# Altium schematic sheet SEQ.SchDoc
size A2
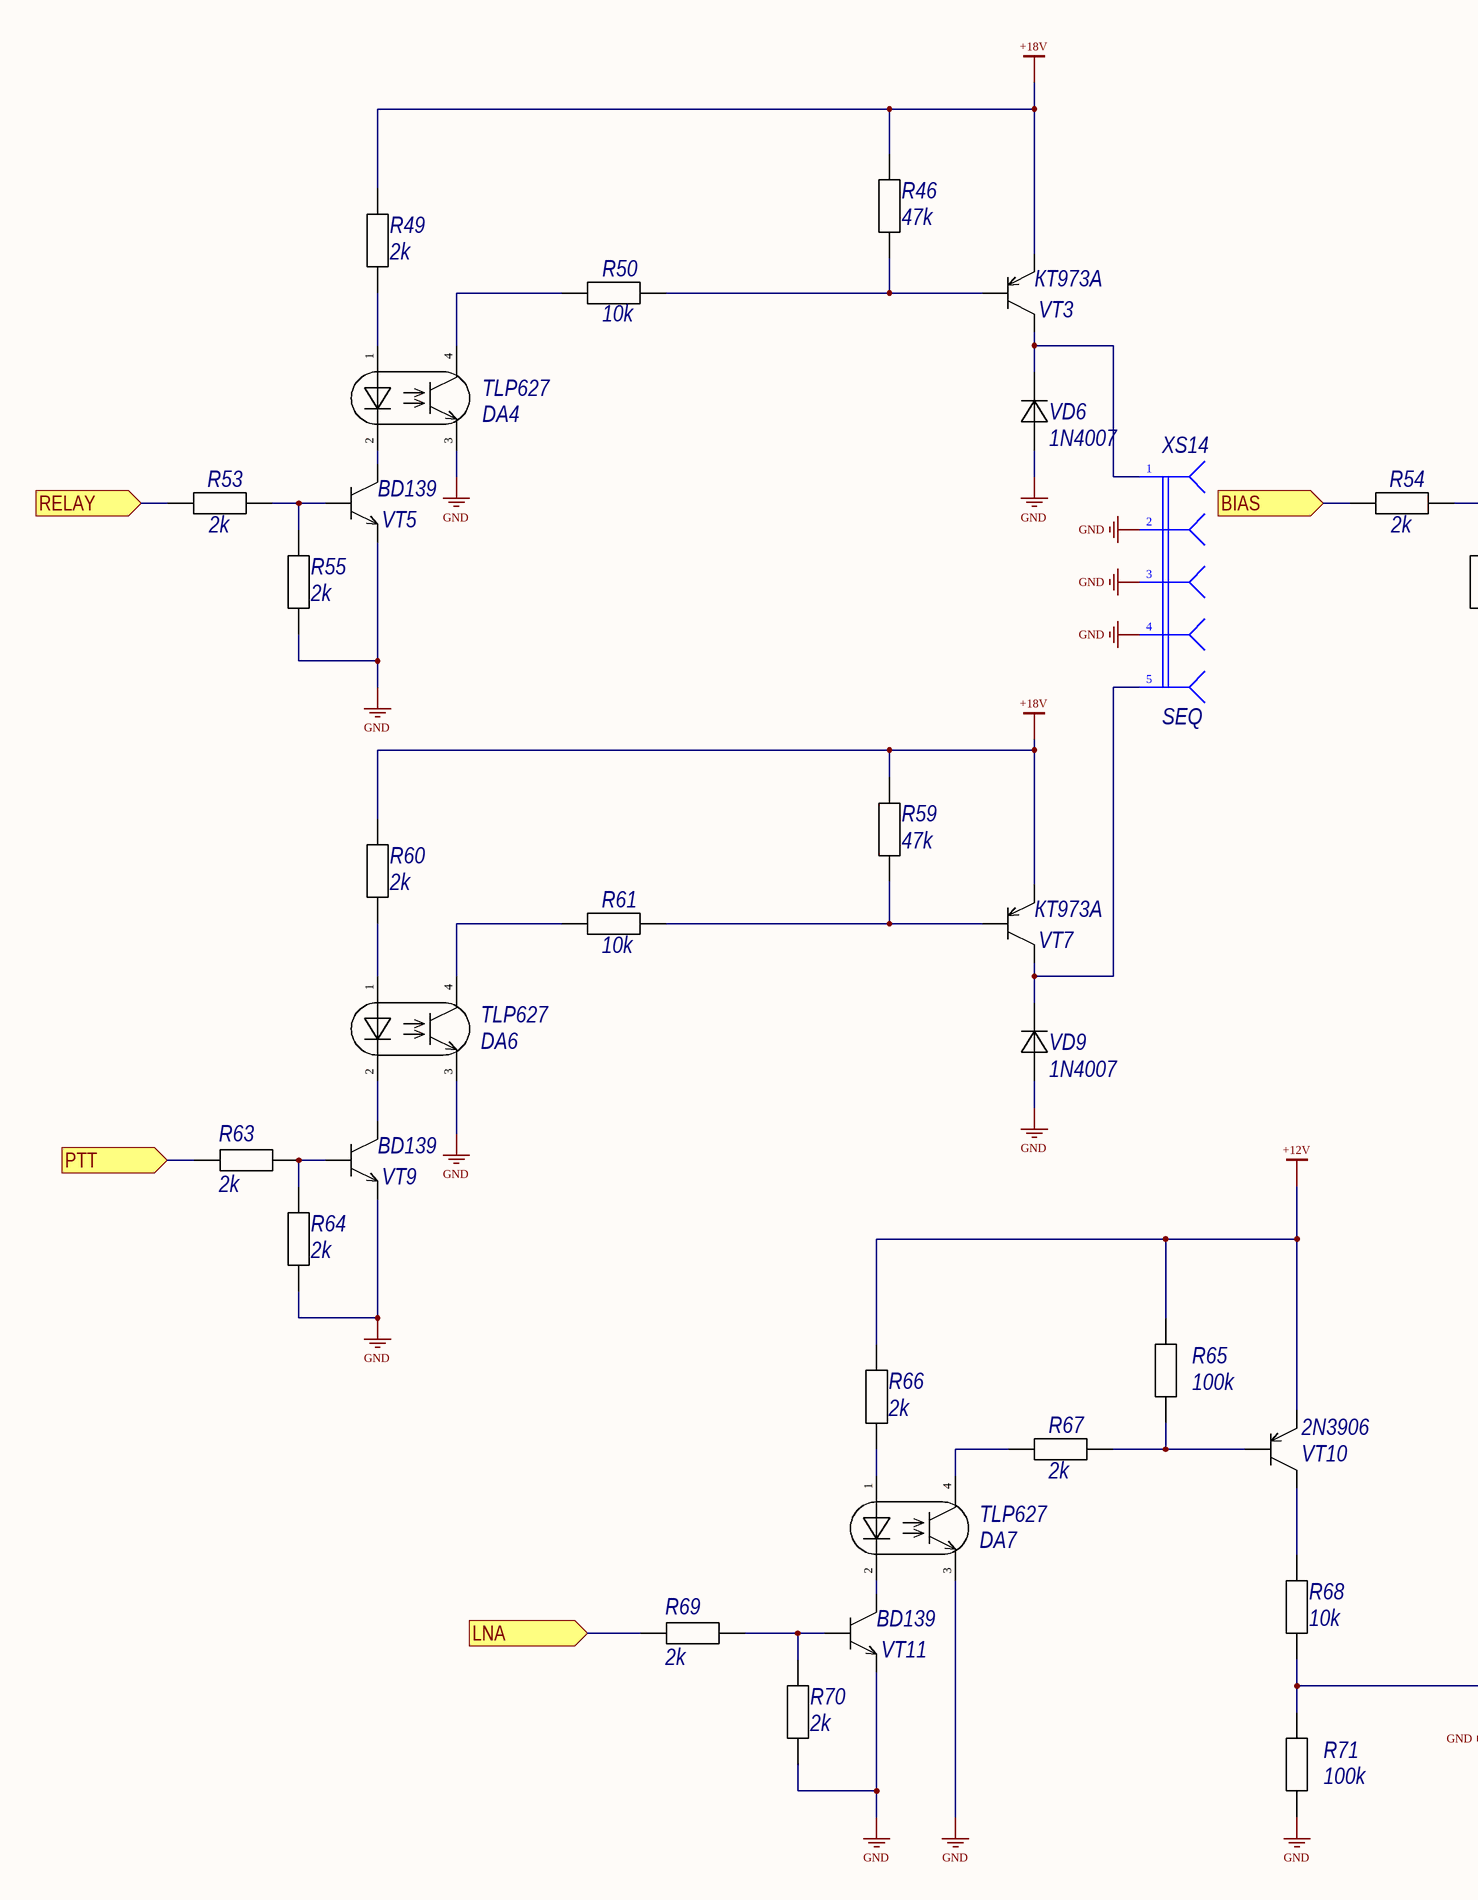
[diagram p0: SEQ.SchDoc, left]
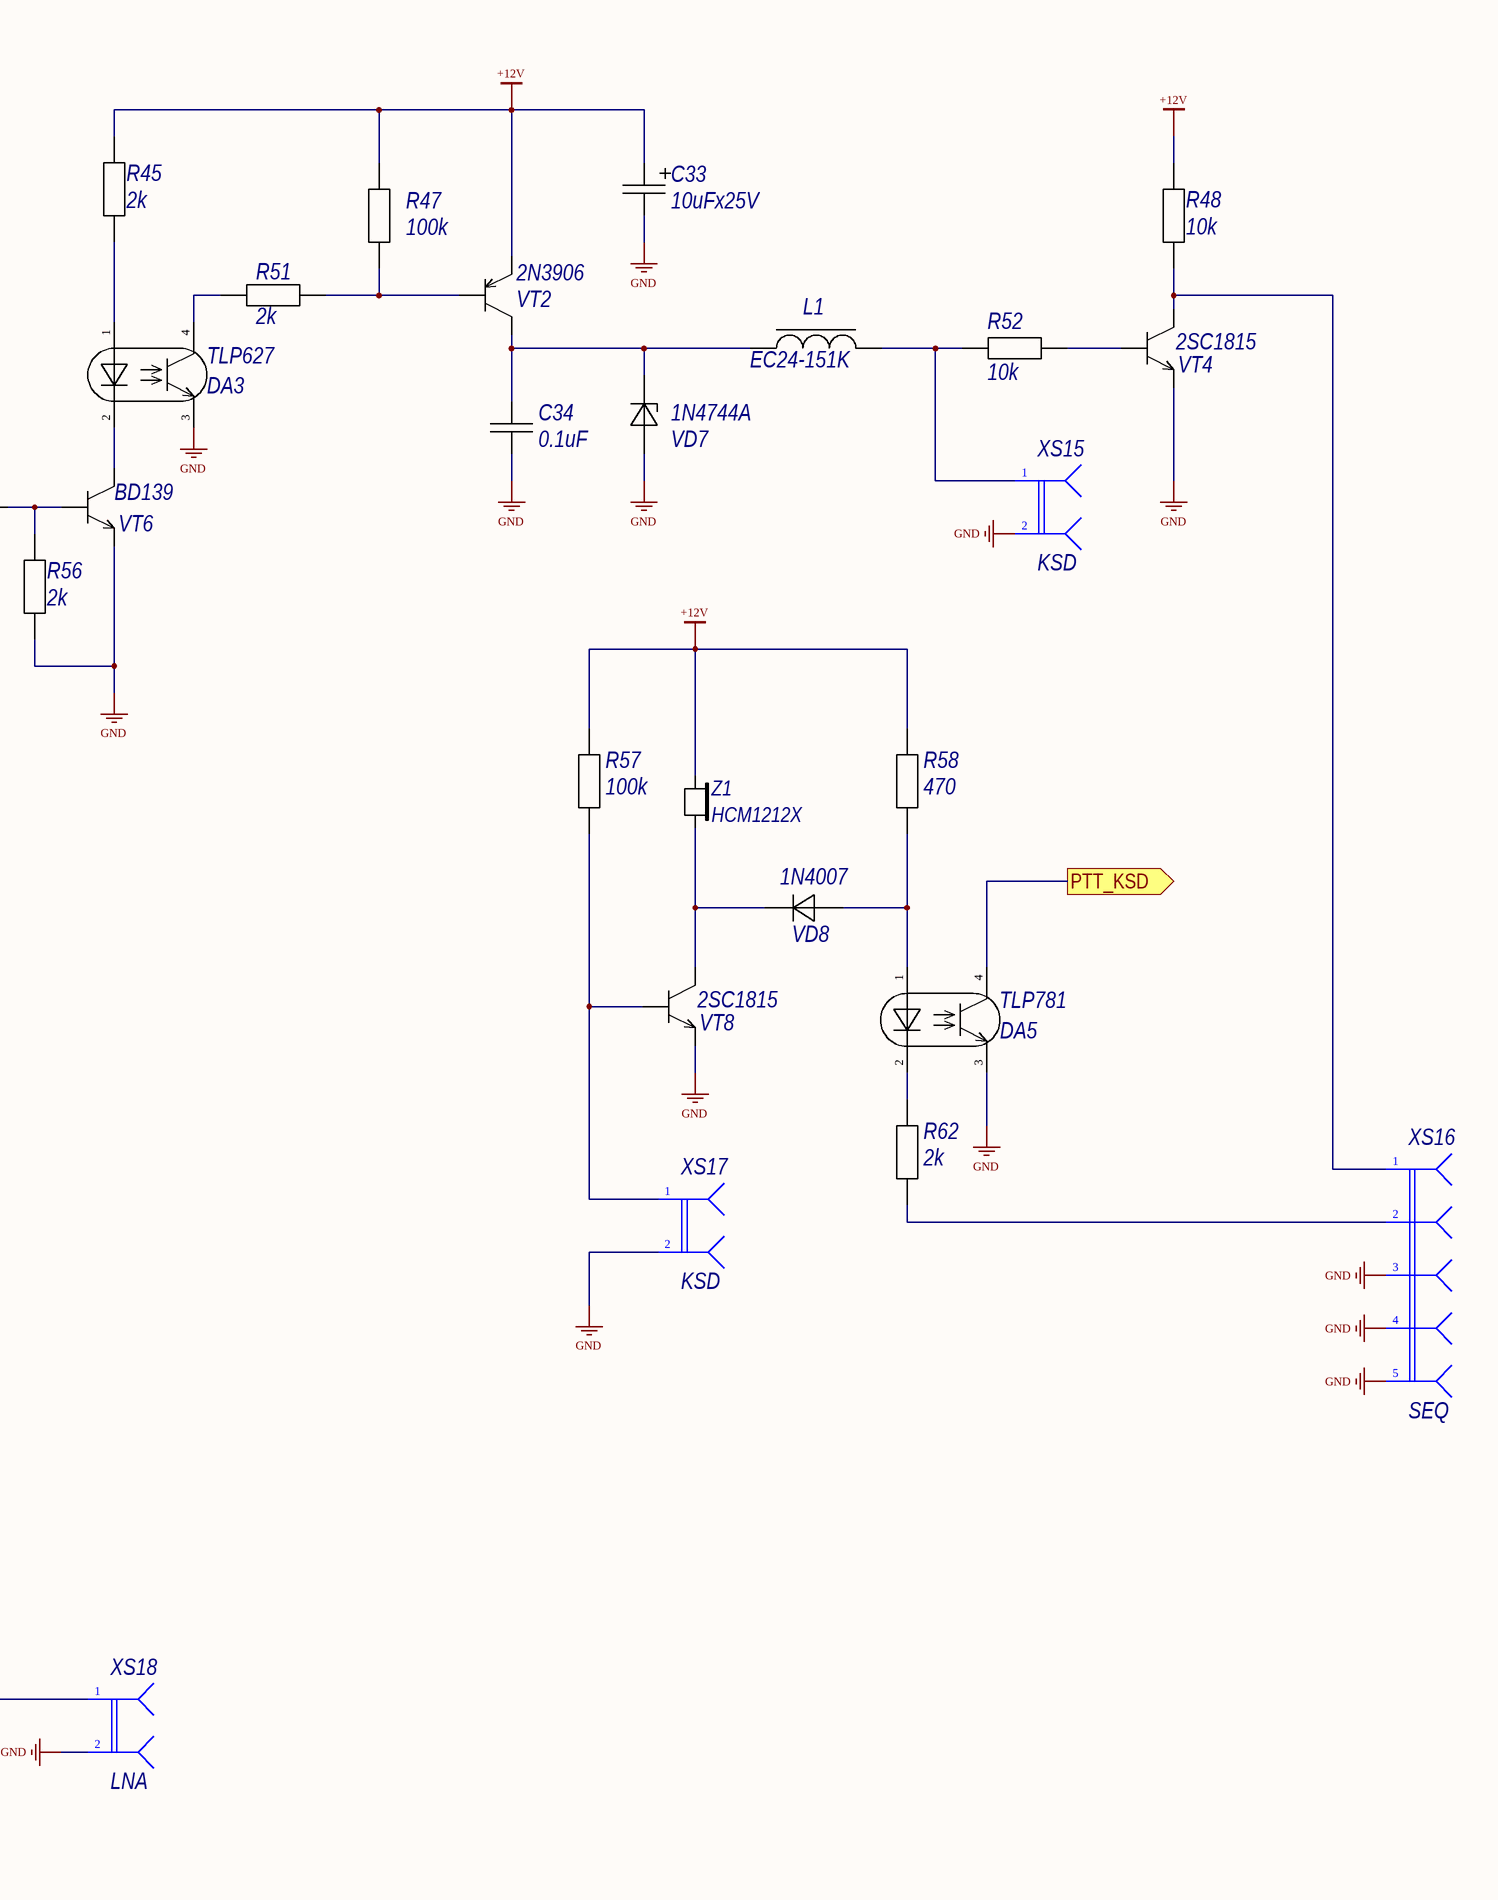
[diagram p1: SEQ.SchDoc, right]

## Parts
C33  10uFx25V  [TECAP_A]
C34  0.1uF  [C0805C]
DA3  TLP627  [DIP-4]
DA4  TLP627  [DIP-4]
DA5  TLP781  [DIP-4]
DA6  TLP627  [DIP-4]
DA7  TLP627  [DIP-4]
L1  EC24-151K  [AXIAL-0.6]
R45  2k  [AXIAL-0.6]
R46  47k  [AXIAL-0.6]
R47  100k  [AXIAL-0.6]
R48  10k  [AXIAL-0.6]
R49  2k  [AXIAL-0.6]
R50  10k  [AXIAL-0.6]
R51  2k  [AXIAL-0.6]
R52  10k  [AXIAL-0.6]
R53  2k  [AXIAL-0.6]
R54  2k  [AXIAL-0.6]
R55  2k  [AXIAL-0.6]
R56  2k  [AXIAL-0.6]
R57  100k  [AXIAL-0.6]
R58  470  [AXIAL-0.6]
R59  47k  [AXIAL-0.6]
R60  2k  [AXIAL-0.6]
R61  10k  [AXIAL-0.6]
R62  2k  [AXIAL-0.6]
R63  2k  [AXIAL-0.6]
R64  2k  [AXIAL-0.6]
R65  100k  [AXIAL-0.6]
R66  2k  [AXIAL-0.6]
R67  2k  [AXIAL-0.6]
R68  10k  [AXIAL-0.6]
R69  2k  [AXIAL-0.6]
R70  2k  [AXIAL-0.6]
R71  100k  [AXIAL-0.6]
VD6  1N4007  [DO-41]
VD7  1N4744A  [DO-41]
VD8  1N4007  [DO-41]
VD9  1N4007  [DO-41]
VT2  2N3906  [TO-92-A]
VT3  КТ973А  [TO-126]
VT4  2SC1815  [TO-92-A]
VT5  BD139  [TO-126]
VT6  BD139  [TO-126]
VT7  КТ973А  [TO-126]
VT8  2SC1815  [TO-92-A]
VT9  BD139  [TO-126]
VT10  2N3906  [TO-92-A]
VT11  BD139  [TO-126]
XS14  SEQ  [WF-5]
XS15  KSD  [WF-2]
XS16  SEQ  [WF-5]
XS17  KSD  [WF-2]
XS18  LNA  [WF-2]
Z1  HCM1212X  [HCM1206X]

## Ports
BIAS (in), LNA (in), PTT (in), PTT_KSD (out), RELAY (in)

## Nets
+12V: C33.1 R45.2 R47.1 R48.2 R57.2 R58.2 R65.1 R66.2 VT2.3(Э) VT10.3(Э) Z1.2
+18V: R46.1 R49.2 R59.1 R60.2 VT3.3(Э) VT7.3(Э)
GND: C33.2 C34.2 DA3.3(Э) DA4.3(Э) DA5.3(Э) DA6.3(Э) DA7.3(Э) R55.1 R56.1 R64.1 R70.1 R71.2 VD6.2 VD7.1(А) VD9.2 VT4.3(Э) VT5.3(Э) VT6.3(Э) VT8.3(Э) VT9.3(Э) VT11.3(Э) XS14.2 XS14.3 XS14.4 XS15.2 XS16.3 XS16.4 XS16.5 XS17.2 XS18.2
BIAS: R54.2 ; port BIAS
LNA: R69.2 ; port LNA
PTT: R63.2 ; port PTT
PTT_KSD: DA5.4(К) ; port PTT_KSD
RELAY: R53.2 ; port RELAY
NetC34_1: C34.1 L1.1 VD7.2(К) VT2.2(К)
NetDA3_1: DA3.1(CА) R45.1
NetDA3_2: DA3.2(CК) VT6.2(К)
NetDA3_4: DA3.4(К) R51.2
NetDA4_1: DA4.1(CА) R49.1
NetDA4_2: DA4.2(CК) VT5.2(К)
NetDA4_4: DA4.4(К) R50.2
NetDA5_1: DA5.1(CА) R58.1 VD8.2
NetDA5_2: DA5.2(CК) R62.2
NetDA6_1: DA6.1(CА) R60.1
NetDA6_2: DA6.2(CК) VT9.2(К)
NetDA6_4: DA6.4(К) R61.2
NetDA7_1: DA7.1(CА) R66.1
NetDA7_2: DA7.2(CК) VT11.2(К)
NetDA7_4: DA7.4(К) R67.2
NetL1_2: L1.2 R52.1 XS15.1
NetR46_2: R46.2 R50.1 VT3.1(Б)
NetR47_2: R47.2 R51.1 VT2.1(Б)
NetR48_1: R48.1 VT4.2(К) XS16.1
NetR52_2: R52.2 VT4.1(Б)
NetR53_1: R53.1 R55.2 VT5.1(Б)
NetR54_1: R54.1 R56.2 VT6.1(Б)
NetR57_1: R57.1 VT8.1(Б) XS17.1
NetR59_2: R59.2 R61.1 VT7.1(Б)
NetR62_1: R62.1 XS16.2
NetR63_1: R63.1 R64.2 VT9.1(Б)
NetR65_2: R65.2 R67.1 VT10.1(Б)
NetR68_1: R68.1 R71.1 XS18.1
NetR68_2: R68.2 VT10.2(К)
NetR69_1: R69.1 R70.2 VT11.1(Б)
NetVD6_1: VD6.1 VT3.2(К) XS14.1
NetVD8_1: VD8.1 VT8.2(К) Z1.1
NetVD9_1: VD9.1 VT7.2(К) XS14.5

## Library data of the parts
C33 = CAP_TECAP_A: Type: Конденсатор; Published: 20.08.2010; Publisher: Andrew Danich
C34 = CAP_0805: Type: Конденсатор; Published: 18.05.2010; Publisher: Andrew Danich
L1 = IND_BIAS: Type: Дроссель; Published: 20.05.2010; Publisher: Andrew Danich
R45-R71 = RES_1W: Published: 24.03.2010; Publisher: Andrew Danich; Type: Резистор
VD6 VD8 VD9 = 1N4007: Type: Диод; Published: 18.05.2010; Publisher: Andrew Danich
VD7 = 1N4744A: Type: Стабилитрон; Published: 20.05.2013; Publisher: Andrew Danich
VT2 VT10 = 2N3906: Type: Транзистор; Published: 07.05.2013; Publisher: Andrew Danich
VT3 VT7 = КТ973А: Type: Транзистор; Published: 07.05.2013; Publisher: Andrew Danich
VT4 VT8 = 2SC1815: Type: Транзистор; Published: 07.05.2013; Publisher: Andrew Danich
VT5 VT6 VT9 VT11 = BD139: Type: Транзистор; Published: 07.05.2013; Publisher: Andrew Danich
XS14 XS16 = CONNECT_SEQ: Value: Connector; Published: 07.03.2013; Publisher: Andrew Danich; Type: Розетка
XS15 XS17 XS18 = CONNECT_KSD: Value: Connector; Published: 07.03.2013; Publisher: Andrew Danich; Type: Розетка
DA3 DA4 DA6 DA7 = TLP627: Published: 09.01.2017; Publisher: Andrew Danich; Type: Микросхема
DA5 = TLP781: Published: 09.01.2017; Publisher: Andrew Danich; Type: Микросхема